# EAGLE design BatteryHullBoard (EAGLE 8.3.2)
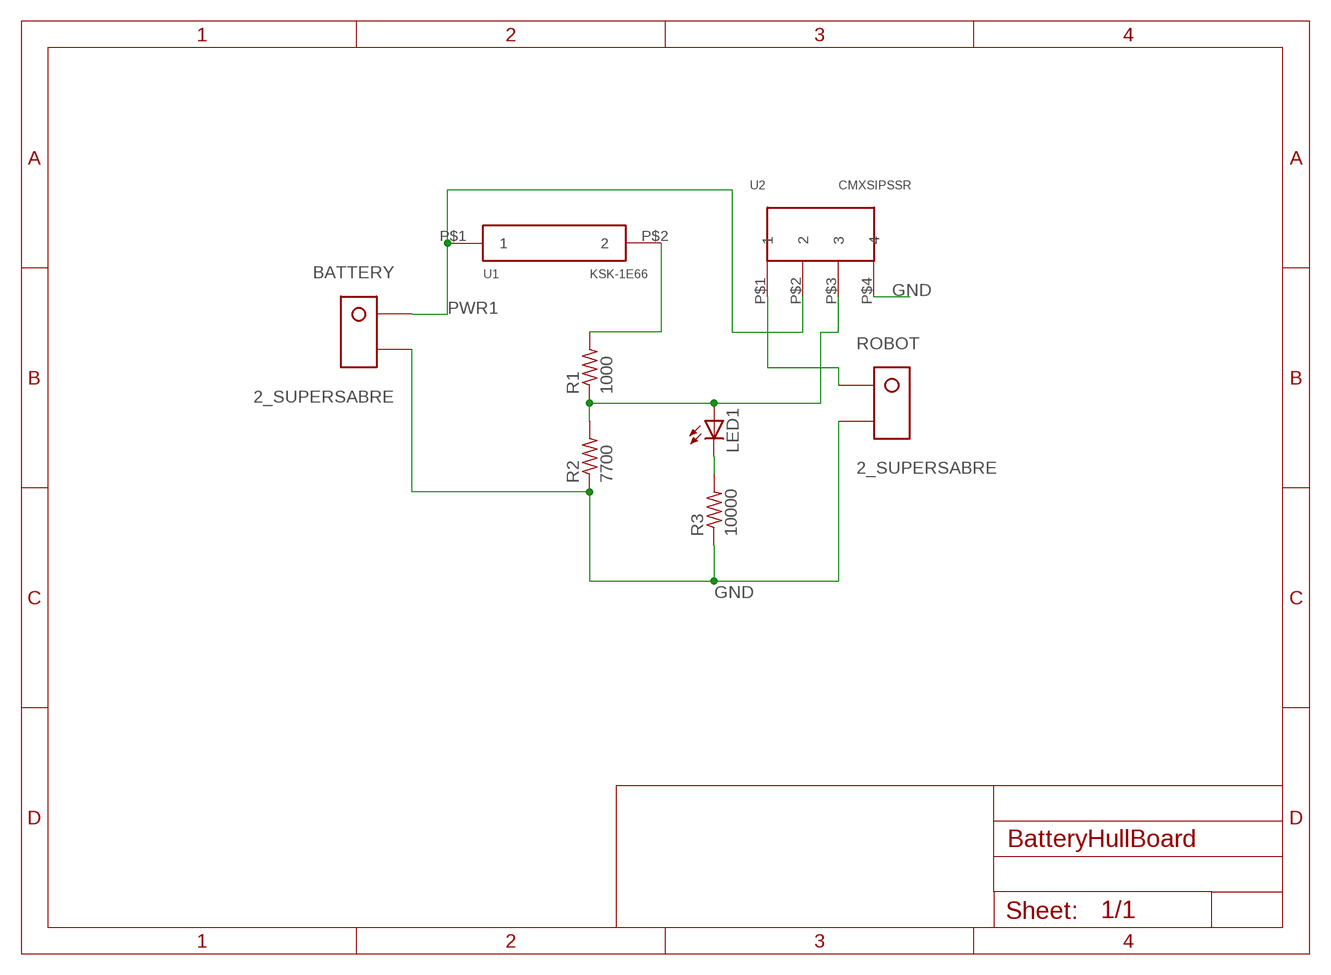
[diagram p0: schematic, sheet 1]

## Parts
BATTERY  2_SUPERSABRE  [SUPERSABRE_2CIRCUIT]
LED1  LED5MM  [LED5MM]
R1  1000  R-US_R0805  [R0805]
R2  7700  R-US_R0805  [R0805]
R3  10000  R-US_R0805  [R0805]
ROBOT  2_SUPERSABRE  [SUPERSABRE_2CIRCUIT]
U1  KSK-1E66  [KSK-1E66]
U2  CMXSIPSSR  [CMXSIPSSR]

## Nets
GND: BATTERY.P$2 R2.1 R3.1 ROBOT.P$2 U2.P$4
N$1: R1.2 U1.P$2
N$3: LED1.A R1.1 R2.2 U2.P$3
N$4: LED1.K(C) R3.2
PWR1: BATTERY.P$1 U1.P$1 U2.P$2
PWR2: ROBOT.P$1 U2.P$1

## Library data of the parts
BATTERY ROBOT = molex:2_SUPERSABRE: Molex SuperSabre 2-pin vertical header
LED1 = led:LED: LED OSRAM: - CHIPLED LG R971, LG N971, LY N971, LG Q971, LY Q971, LO R971, LY R971 LH N974, LH R974 LS Q976, LO Q976, LY Q976 LO Q996 - Hyper CHIPLED LW Q18S LB Q993, LB Q99A, LB R99A - SideLED LS A670, LO A670, LY A670, LG A670, LP A670 LB A673, LV A673, LT A673, LW A673 LH A674 LY A675 LS A676, LA A676, LO A676, LY A676, LW A676 LS A679, LY A679, LG A679 - Hyper Micro SIDELED® LS Y876, LA Y876, LO Y876, LY Y876 LT Y87S - SmartLED LW L88C, LW L88S LB L89C, LB L89S, LG L890 LS L89K, LO L89K, LY L89K LS L896, LA L896, LO L896, LY L896 - TOPLED LS T670, LO T670, LY T670, LG T670, LP T670 LSG T670, LSP T670, LSY T670, LOP T670, LYG T670 LG T671, LOG T671, LSG T671 LB T673, LV T673, LT T673, LW T673 LH T674 LS T676, LA T676, LO T676, LY T676, LB T676, LH T676, LSB T676, LW T676 LB T67C, LV T67C, LT T67C, LS T67K, LO T67K, LY T67K, LW E67C LS E67B, LA E67B, LO E67B, LY E67B, LB E67C, LV E67C, LT E67C LW T67C LS T679, LY T679, LG T679 LS T770, LO T770, LY T770, LG T770, LP T770 LB T773, LV T773, LT T773, LW T773 LH T774 LS E675, LA E675, LY E675, LS T675 LS T776, LA T776, LO T776, LY T776, LB T776 LHGB T686 LT T68C, LB T68C - Hyper Mini TOPLED® LB M676 - Mini TOPLED Santana® LG M470 LS M47K, LO M47K, LY M47K Source: http://www.osram.convergy.de LUXEON: - LUMILED® LXK2-PW12-R00, LXK2-PW12-S00, LXK2-PW14-U00, LXK2-PW14-V00 LXK2-PM12-R00, LXK2-PM12-S00, LXK2-PM14-U00 LXK2-PE12-Q00, LXK2-PE12-R00, LXK2-PE12-S00, LXK2-PE14-T00, LXK2-PE14-U00 LXK2-PB12-K00, LXK2-PB12-L00, LXK2-PB12-M00, LXK2-PB14-N00, LXK2-PB14-P00, LXK2-PB14-Q00 LXK2-PR12-L00, LXK2-PR12-M00, LXK2-PR14-Q00, LXK2-PR14-R00 LXK2-PD12-Q00, LXK2-PD12-R00, LXK2-PD12-S00 LXK2-PH12-R00, LXK2-PH12-S00 LXK2-PL12-P00, LXK2-PL12-Q00, LXK2-PL12-R00 Source: www.luxeon.com KINGBRIGHT: KA-3528ASYC Source: www.kingbright.com
R1-R3 = resistor:R-US_: RESISTOR, American symbol
U1 = KSK-1E66:KSK-1E66: KSK-1E66: Latching magentic reed switch
U2 = CMXSIPSSR:CMXSIPSSR: CMX SIP SSR (Relay) for use on the Battery Hull Board

## Board
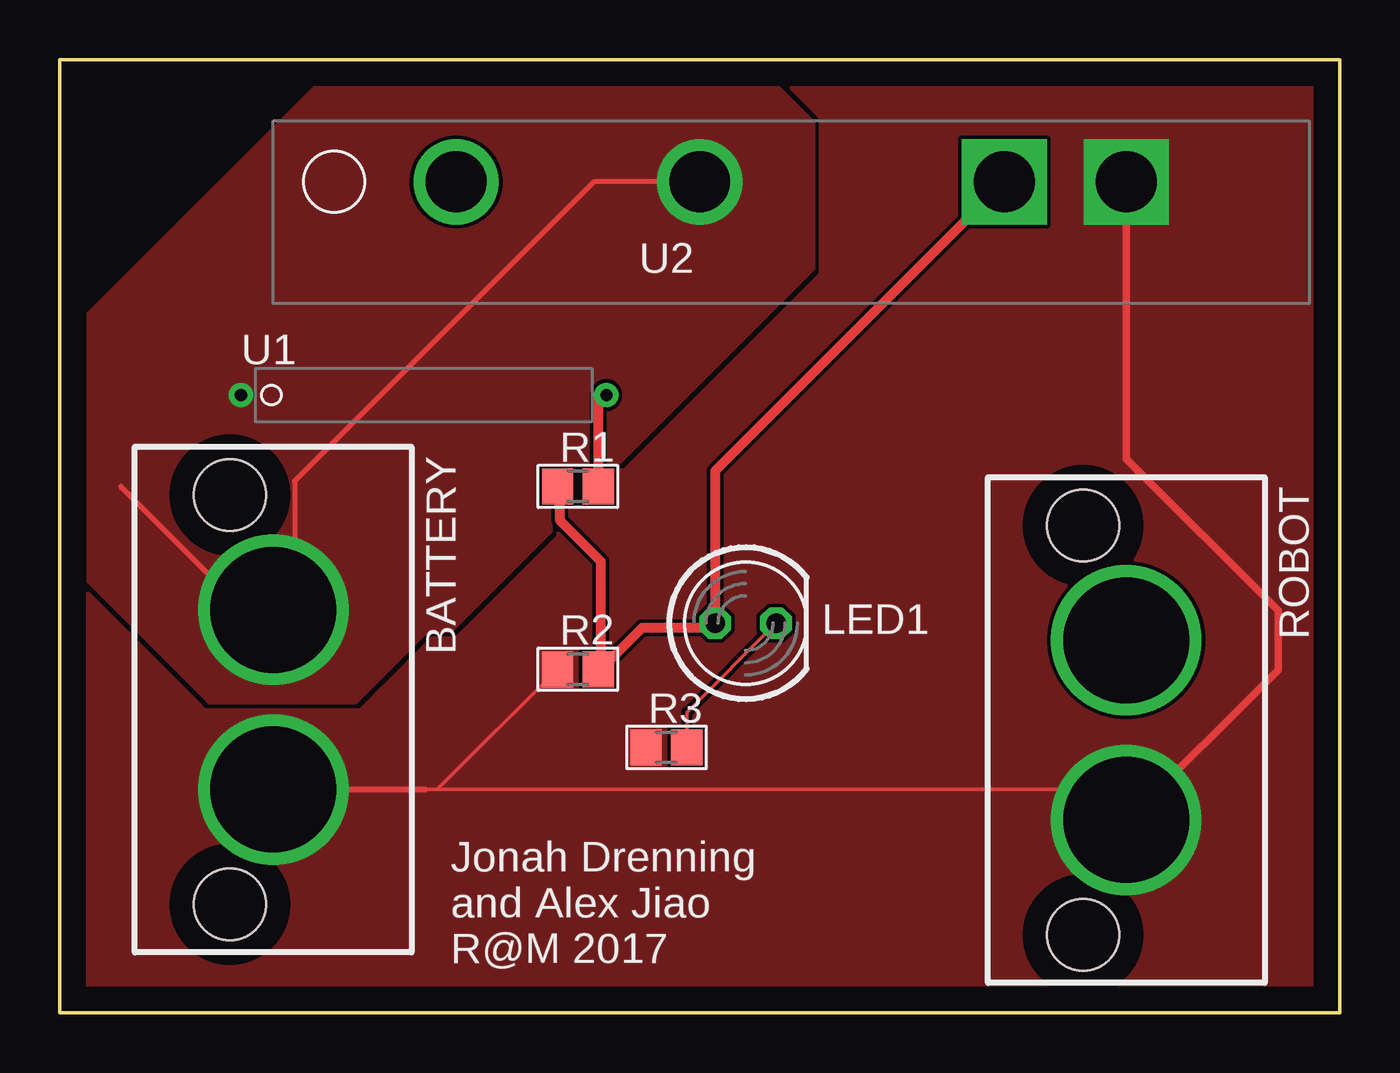
[diagram p1: board, top side]
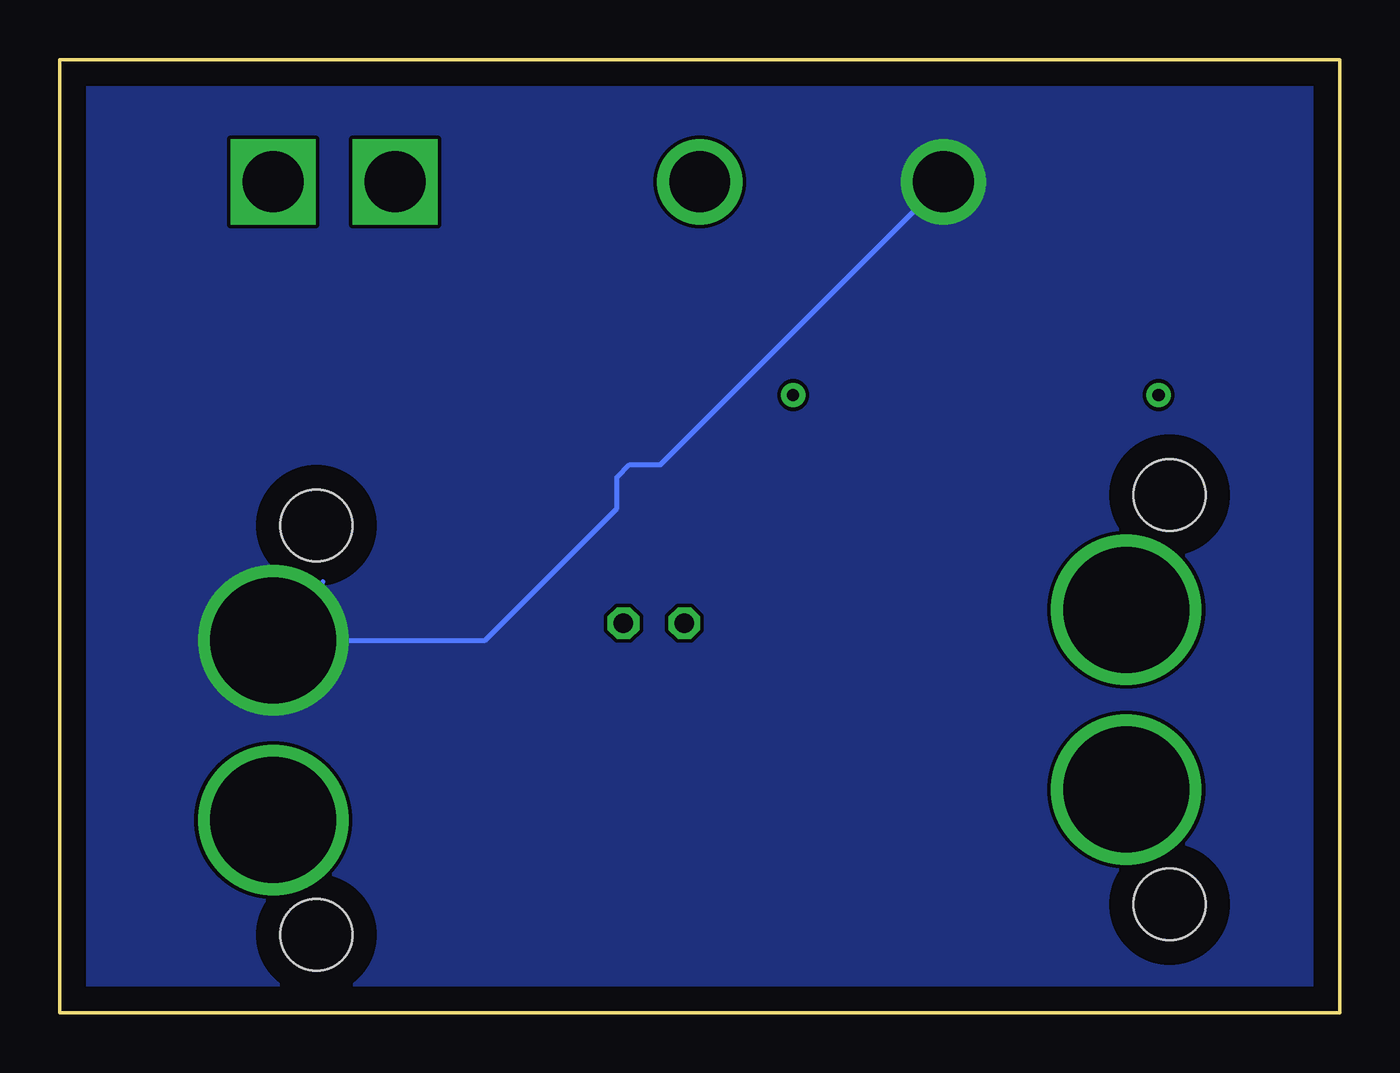
[diagram p2: board, bottom side, seen from below]

Size 53.34 x 39.72 mm. Coordinates in mm from the lower left corner, seen from the top.
Outline: 53.34,0 0,0 0,39.72 53.34,39.72 53.34,0
Copper layers (1*16): Top 0.035mm / dielectric 1.5mm / Bottom 0.035mm
Design rules "default": minimum track width 6mil, minimum drill 0.35mm, track to track 6mil, track to pad 6mil, pad to pad 6mil, via to via 6mil, smd to smd 6mil, copper to edge 40mil, drill to drill 6mil, minimum pad ring 10mil, minimum via ring 8mil, stop-mask expansion 4mil, vias tented up to drill 0mil, thermal gap 10mil

### Footprints (pad centres in the part's own frame; a part is rotated, then mirrored left to right if it is on the bottom)
SUPERSABRE_2CIRCUIT = drill 5.25: P$1 -3.747,0; P$2 3.747,0 | hole 2.997: -8.534,-1.803; 8.534,-1.803
LED5MM = drill 0.813 octagon: A -1.27,0; K 1.27,0
R0805 = smd 1.3 x 1.5: 1 -0.85,0; 2 0.85,0
KSK-1E66 = drill 0.508 pad 0.762: P$1 -7.62,0; P$2 7.62,0
CMXSIPSSR = drill 2.54 pad 3.302: P$1 -13.97,1.27; P$2 -3.81,1.27 | drill 2.54 pad 3.302 square: P$3 8.89,1.27; P$4 13.97,1.27

### Placement (x,y rotation side)
BATTERY  8.89,13.05 270 top
LED1  28.58,16.24 0 top
R1  21.59,21.94 0 top
R2  21.59,14.32 0 top
R3  25.28,11.06 0 top
ROBOT  44.45,11.78 270 top
U1  15.16,25.75 0 top
U2  30.48,33.37 0 top

### Tracks (layer width: path | path; a pad name or v marks a point on that pad's centre or on a via)
GND
  Top 0.152: 15.24,9.3 15.72,9.3 | 15.72,9.3 R2.1 | 15.72,9.3 43.12,9.3 44.45,7.97
  Top 0.254: BATTERY.P$2 15.24,9.3
  Top 0.305: U2.P$4 44.45,23.09 50.78,16.76 50.78,14.3 44.45,7.97
  pour Top (isolate 0, rank 4, no thermals): -0.12,39.76 -0.12,0.16 53.28,0.16 53.28,39.76
N$1
  Top 0.406: U1.P$2 22.44,25.75 R1.2
N$3
  Top 0.406: U2.P$3 27.31,22.58 LED1.A 27.13,16.06 24.28,16.06 22.54,14.32 | 22.54,14.32 R2.2 | R1.1 20.83,21.85 20.83,20.54 22.54,18.83 22.54,14.32
N$4
  Top 0.152: R3.2 26.13,12.52 LED1.K
PWR1
  Top 0.152: 6.35,18.13 7.56,18.13 BATTERY.P$1
  Top 0.2: 2.54,21.94 6.35,18.13 | U2.P$2 22.26,34.64 9.78,22.16 9.78,17.69 BATTERY.P$1
  pour Top (no thermals): 1.28,18.06 6.28,13.06 12.28,13.06 15.28,16.06 16.28,16.06 21.28,21.06 31.28,31.06 31.28,37.06 29.28,39.06 11.28,39.06 1.28,29.06
PWR2
  Bottom 0.2: U2.P$1 28.3,22.85 29.59,22.85 30.12,22.32 30.12,21.03 35.62,15.53 ROBOT.P$1 44.45,15.89 42.38,17.96
  pour Bottom (isolate 0): 12.78,37.96 12.88,38.06 20.28,38.06 32.18,26.16 48.78,26.16 51.68,23.26 51.68,12.86 51.08,12.26 32.78,12.26 14.38,30.66 9.08,30.66 9.08,37.66 9.38,37.96
  pour Bottom (isolate 0, no thermals): -0.02,39.66 53.38,39.66 53.38,0.06 -0.02,0.06

### Text on the board
tPlace: Jonah Drenning / and Alex Jiao / R@M 2017